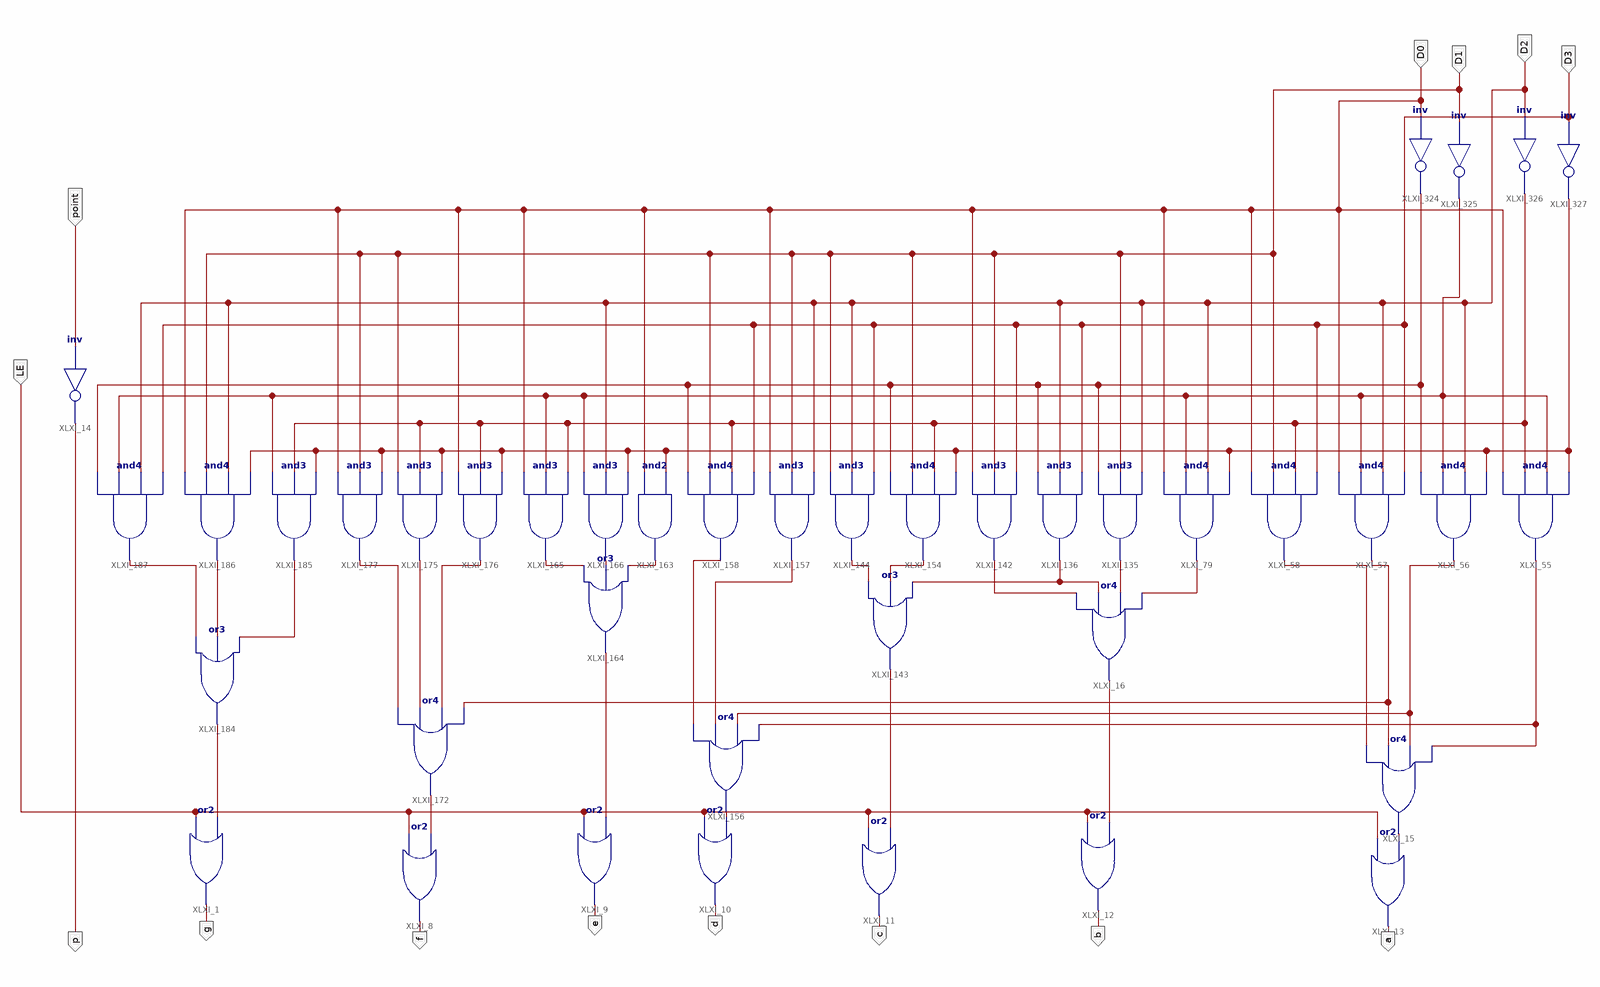
[diagram p0: schematic sheet 1]
// Xilinx ISE schematic MC14495_ZJU.sch (kintex7) as structural Verilog: 40 symbols, 14 ports
module MC14495_ZJU (
  input  point,
  input  LE,
  input  D1,
  input  D3,
  input  D2,
  input  D0,
  output d,
  output e,
  output f,
  output g,
  output p,
  output a,
  output b,
  output c
);

  wire XLXN_14, XLXN_107, XLXN_110, XLXN_137, XLXN_138, XLXN_139, XLXN_140, XLXN_183, XLXN_198, XLXN_200,
       XLXN_205, XLXN_209, XLXN_210, XLXN_215, XLXN_218, XLXN_219, XLXN_221, XLXN_234, XLXN_235, XLXN_236,
       XLXN_265, XLXN_405, XLXN_406, XLXN_407, XLXN_434, XLXN_439, XLXN_464, XLXN_465, XLXN_472, XLXN_546,
       XLXN_563, XLXN_571;

  and XLXI_176 (XLXN_236, D0, XLXN_571, XLXN_546);
  and XLXI_175 (XLXN_235, D1, XLXN_571, XLXN_546);
  and XLXI_177 (XLXN_234, D0, D1, XLXN_546);
  or XLXI_172 (XLXN_465, XLXN_234, XLXN_235, XLXN_236, XLXN_434);
  and XLXI_185 (XLXN_407, XLXN_472, XLXN_571, XLXN_546);
  or XLXI_15 (XLXN_14, XLXN_110, XLXN_434, XLXN_439, XLXN_107);
  and XLXI_56 (XLXN_439, XLXN_563, XLXN_472, D2, XLXN_546);
  and XLXI_55 (XLXN_107, D0, XLXN_571, XLXN_472, XLXN_546);
  and XLXI_57 (XLXN_434, D0, XLXN_472, D2, D3);
  and XLXI_58 (XLXN_110, D0, D1, XLXN_571, D3);
  or XLXI_16 (XLXN_464, XLXN_140, XLXN_139, XLXN_138, XLXN_137);
  and XLXI_79 (XLXN_137, D0, XLXN_472, D2, XLXN_546);
  and XLXI_142 (XLXN_140, D0, D1, D3);
  and XLXI_136 (XLXN_139, XLXN_563, D2, D3);
  and XLXI_135 (XLXN_138, XLXN_563, D1, D2);
  and XLXI_157 (XLXN_209, D0, D1, D2);
  or XLXI_156 (XLXN_205, XLXN_210, XLXN_209, XLXN_439, XLXN_107);
  or XLXI_10 (d, LE, XLXN_205);
  and XLXI_158 (XLXN_210, XLXN_563, D1, XLXN_571, D3);
  and XLXI_163 (XLXN_218, D0, XLXN_546);
  and XLXI_166 (XLXN_219, XLXN_472, D2, XLXN_546);
  or XLXI_164 (XLXN_215, XLXN_221, XLXN_219, XLXN_218);
  and XLXI_165 (XLXN_221, D0, XLXN_472, XLXN_571);
  or XLXI_143 (XLXN_183, XLXN_198, XLXN_200, XLXN_139);
  and XLXI_154 (XLXN_200, XLXN_563, D1, XLXN_571, XLXN_546);
  and XLXI_144 (XLXN_198, D1, D2, D3);
  or XLXI_9 (e, LE, XLXN_215);
  or XLXI_8 (f, LE, XLXN_465);
  and XLXI_186 (XLXN_406, D0, D1, D2, XLXN_546);
  and XLXI_187 (XLXN_405, XLXN_563, XLXN_472, D2, D3);
  or XLXI_1 (g, LE, XLXN_265);
  or XLXI_184 (XLXN_265, XLXN_405, XLXN_406, XLXN_407);
  not XLXI_14 (p, point);
  or XLXI_13 (a, LE, XLXN_14);
  or XLXI_12 (b, LE, XLXN_464);
  or XLXI_11 (c, LE, XLXN_183);
  not XLXI_325 (XLXN_472, D1);
  not XLXI_326 (XLXN_571, D2);
  not XLXI_327 (XLXN_546, D3);
  not XLXI_324 (XLXN_563, D0);
endmodule
